# Altium schematic sheet Controller.SchDoc
size A4
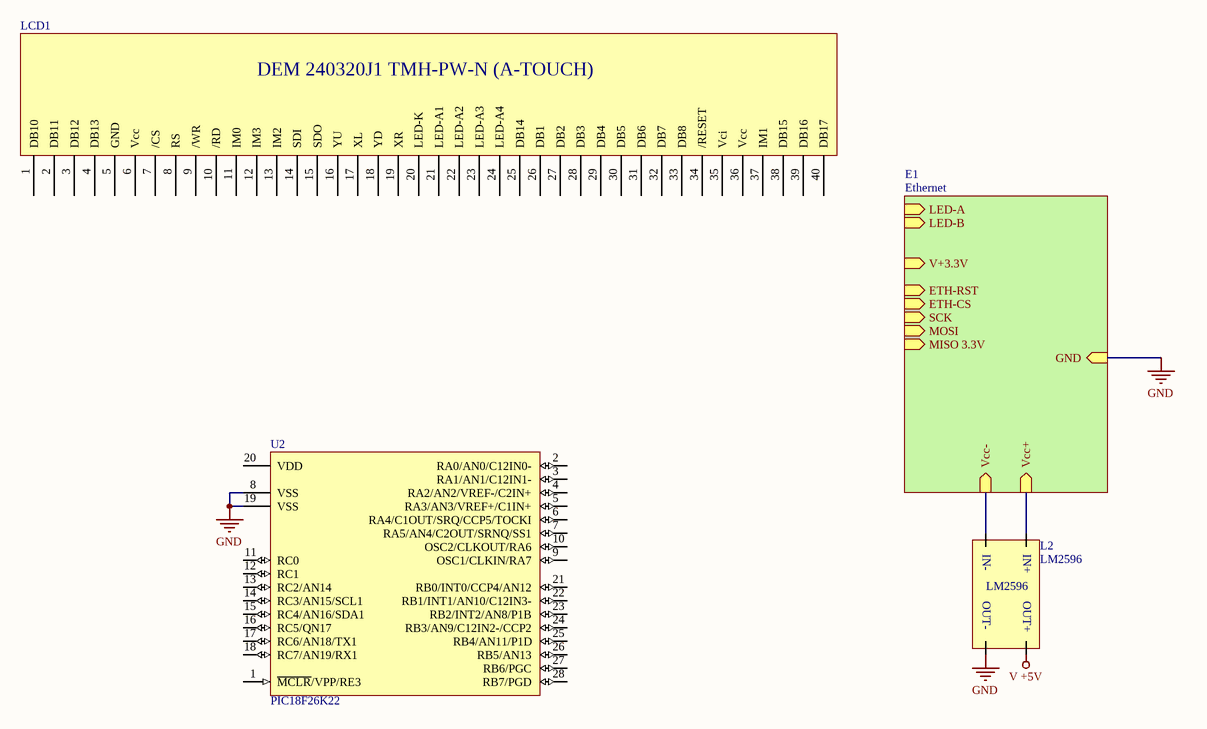
[diagram p0: Controller.SchDoc]

## Parts
L2  LM2596  [LM2596]
LCD1  LCD - 240320J1  [F0500WR-S-40PT]  (value not drawn)
U2  PIC18F26K22  [SSOP-28]

## Sub-sheets
E1 = Ethernet: LED-A (in), LED-B (in), Vcc- (in), Vcc+ (in), V+3.3V (in), GND (in), ETH-RST (in), ETH-CS (in), SCK (in), MOSI (in), MISO 3.3V (in)

## Nets
GND: L2.3 U2.8(VSS) U2.19(VSS) ; sheet E1/GND
V +5V: L2.4
NetL2_1: L2.1 ; sheet E1/Vcc+
NetL2_2: L2.2 ; sheet E1/Vcc-

Not connected (* = marked no-connect by the designer): LCD1 1(DB10) 2(DB11) 3(DB12) 4(DB13) 5(GND) 6(Vcc) 7(/CS) 8(RS) 9(/WR) 10(/RD) 11(IM0) 12(IM3) 13(IM2) 14(SDI) 15(SDO) 16(YU) 17(XL) 18(YD) 19(XR) 20(LED-K) 21(LED-A1) 22(LED-A2) 23(LED-A3) 24(LED-A4) 25(DB14) 26(DB1) 27(DB2) 28(DB3) 29(DB4) 30(DB5) 31(DB6) 32(DB7) 33(DB8) 34(/RESET) 35(Vci) 36(Vcc) 37(IM1) 38(DB15) 39(DB16) 40(DB17); U2 1(~{MCLR}/VPP/RE3) 2(RA0/AN0/C12IN0-) 3(RA1/AN1/C12IN1-) 4(RA2/AN2/VREF-/C2IN+) 5(RA3/AN3/VREF+/C1IN+) 6(RA4/C1OUT/SRQ/CCP5/TOCKI) 7(RA5/AN4/C2OUT/SRNQ/SS1) 9(OSC1/CLKIN/RA7) 10(OSC2/CLKOUT/RA6) 11(RC0) 12(RC1) 13(RC2/AN14) 14(RC3/AN15/SCL1) 15(RC4/AN16/SDA1) 16(RC5/QN17) 17(RC6/AN18/TX1) 18(RC7/AN19/RX1) 20(VDD) 21(RB0/INT0/CCP4/AN12) 22(RB1/INT1/AN10/C12IN3-) 23(RB2/INT2/AN8/P1B) 24(RB3/AN9/C12IN2-/CCP2) 25(RB4/AN11/P1D) 26(RB5/AN13) 27(RB6/PGC) 28(RB7/PGD)

## Notes on the sheet
- (in symbol LCD - 240320J1) DEM 240320J1 TMH-PW-N (A-TOUCH)
- (in symbol LM2596) IN-; IN+; OUT-; OUT+

## Library data of the parts
L2 = LM2596: Modul DC-DC Step Down LM2596 Albastru Intrare 3 - 35 V SMD; Link: https://www.optimusdigital.ro/ro/surse-coboratoare-reglabile/562-modul-dc-dc-step-down-lm2596-albastru-intrare-3-35-v-smd.html
LCD1 = LCD - 240320J1: TFT; 2,4"; 240x320; Ilum: LED; Dim:42,72x60,26x3,9mm; Link: https://www.tme.eu/ro/details/dem240320j1tmh-pwa/afisaje-tft/display-elektronik/dem-240320j1-tmh-pw-n-a-touch/
U2 = PIC18F26K22: Microcontroler PIC; EEPROM:1024B; SRAM:3896B; 64MHz; SSOP28; MinQuantity: 1; Published: 29-Jan-2009; LatestRevisionDate: 02-Dec-2009; LatestRevisionNote: Updated to datasheet revision F, Sep-2009; DatasheetVersion: revF, Sep-2009; PackageVersion: revBB, Aug-2009; PackageReference: SSOP-SS28; Publisher: Altium Limited; PackageDescription: 28-Lead Plastic Shrink Small Outline (SS) - 5.3mm Body [SSOP]; Supplier 1: Digi-Key; Supplier Part Number 1: PIC18F26K20-I/SS-ND; Supplier 2: Farnell; Supplier Part Number 2: 1439582; Code_JEDEC: MS-150; Code_IPC: SOP65P780-28; ComponentLink1Description: Datasheet; ComponentLink1URL: http://ww1.microchip.com/downloads/en/DeviceDoc/41303F.pdf; ComponentLink2Description: Packaging Specification; ComponentLink2URL: http://www.microchip.com/stellent/groups/techpub_sg/documents/packagingspec/en012702.pdf; ComponentLink3Description: Microchip.com Home; ComponentLink3URL: http://www.microchip.com/; Link: http://www.tme.eu/ro/details/pic18f26k22-i_ss/microcontrolere-microchip-de-8-biti/microchip-technology/; Cost: 7.093